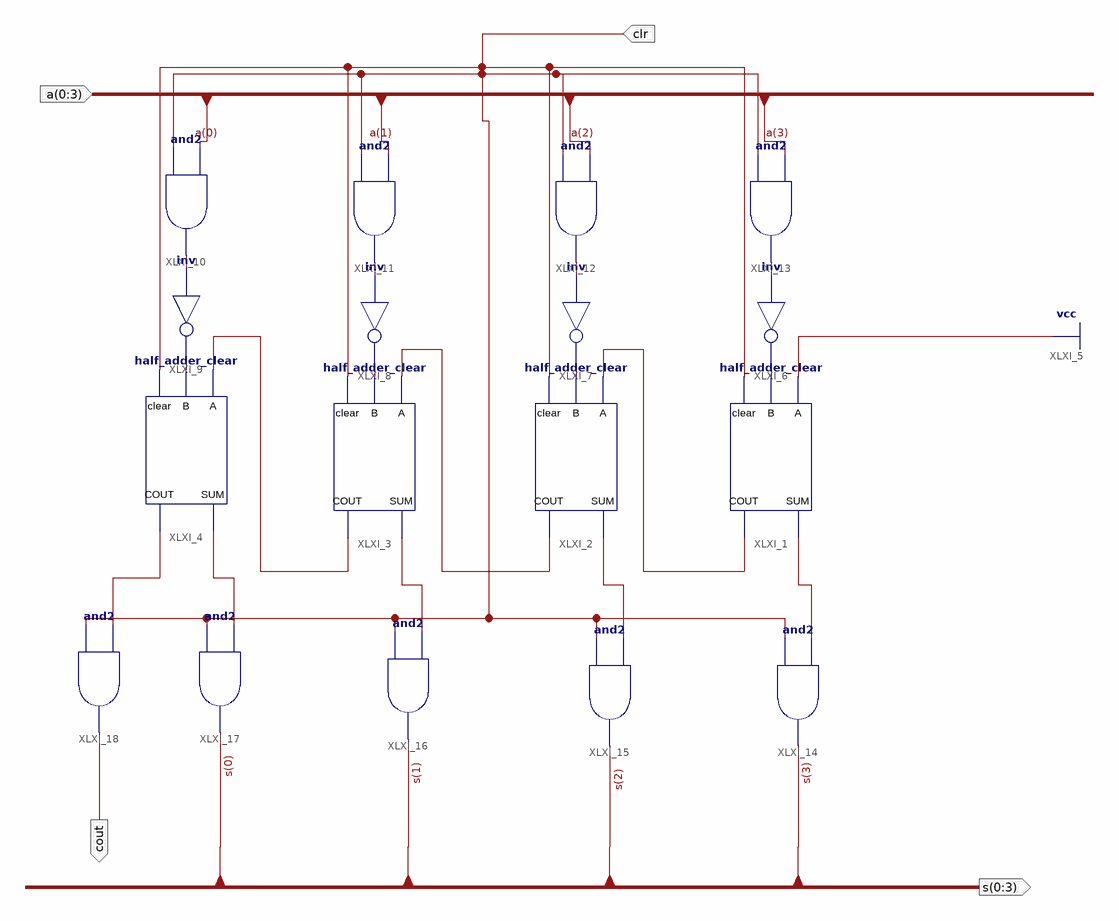
[diagram p0: schematic sheet 1]
// Xilinx ISE schematic fourbit2scomp.sch (artix7) as structural Verilog: 17 symbols, 4 ports
module fourbit2scomp (
  input  [0:3] a,
  input  clr,
  output [0:3] s,
  output cout
);

  wire XLXN_5, XLXN_7, XLXN_8, XLXN_9, XLXN_12, XLXN_13, XLXN_14, XLXN_15, XLXN_21, XLXN_22, XLXN_23,
       XLXN_27, XLXN_28, XLXN_30, XLXN_32, XLXN_41;

  half_adder_clear XLXI_1 (.A(1'b1), .B(XLXN_5), .clear(clr), .SUM(XLXN_27), .COUT(XLXN_21));
  half_adder_clear XLXI_2 (.A(XLXN_21), .B(XLXN_7), .clear(clr), .SUM(XLXN_28), .COUT(XLXN_22));
  half_adder_clear XLXI_3 (.A(XLXN_22), .B(XLXN_8), .clear(clr), .SUM(XLXN_30), .COUT(XLXN_23));
  half_adder_clear XLXI_4 (.A(XLXN_23), .B(XLXN_9), .clear(clr), .SUM(XLXN_32), .COUT(XLXN_41));
  not XLXI_6 (XLXN_5, XLXN_15);
  not XLXI_7 (XLXN_7, XLXN_14);
  not XLXI_8 (XLXN_8, XLXN_13);
  not XLXI_9 (XLXN_9, XLXN_12);
  and XLXI_10 (XLXN_12, clr, a[0]);
  and XLXI_11 (XLXN_13, clr, a[1]);
  and XLXI_12 (XLXN_14, clr, a[2]);
  and XLXI_13 (XLXN_15, clr, a[3]);
  and XLXI_14 (s[3], clr, XLXN_27);
  and XLXI_15 (s[2], clr, XLXN_28);
  and XLXI_16 (s[1], clr, XLXN_30);
  and XLXI_17 (s[0], clr, XLXN_32);
  and XLXI_18 (cout, clr, XLXN_41);
endmodule
